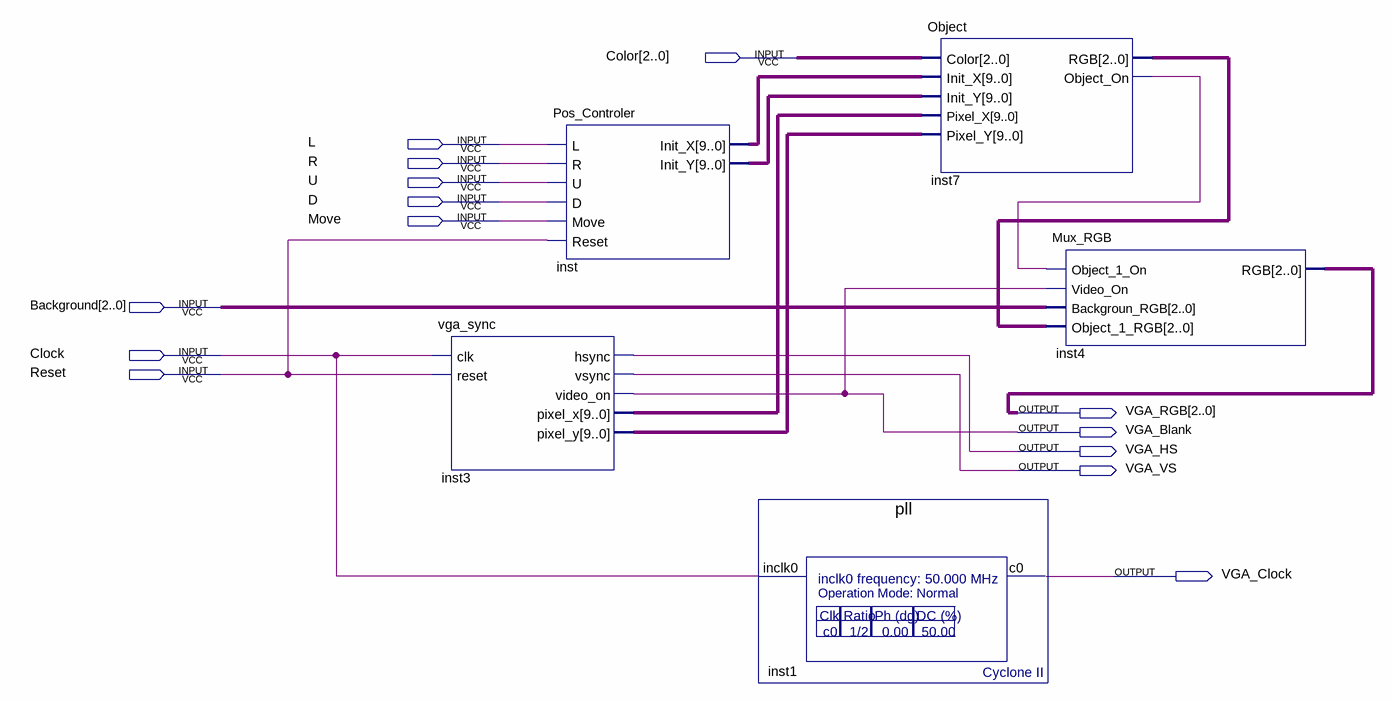
[diagram p0: schematic sheet]
// Quartus schematic vga.bdf as structural Verilog: 5 symbols, 14 pins
module vga (
  input  [2:0] Color,
  input  L,
  input  R,
  input  U,
  input  D,
  input  Move,
  input  [2:0] Background,
  input  Clock,
  input  Reset,
  output [2:0] VGA_RGB,
  output VGA_Blank,
  output VGA_HS,
  output VGA_VS,
  output VGA_Clock
);

  wire inst7_object_on;
  wire [2:0] inst7_rgb;
  wire [9:0] inst3_pixel_x, inst3_pixel_y, inst_init_x, inst_init_y;

  vga_sync inst3 (
    .clk(Clock), .reset(Reset), .hsync(VGA_HS), .vsync(VGA_VS), .video_on(VGA_Blank),
    .pixel_x(inst3_pixel_x), .pixel_y(inst3_pixel_y));
  Pos_Controler inst (
    .L(L), .R(R), .U(U), .D(D), .Move(Move), .Reset(Reset), .Init_X(inst_init_x), .Init_Y(inst_init_y));
  pll inst1 (.inclk0(Clock), .c0(VGA_Clock));
  Object inst7 (
    .Color(Color), .Init_X(inst_init_x), .Init_Y(inst_init_y), .Pixel_X(inst3_pixel_x),
    .Pixel_Y(inst3_pixel_y), .RGB(inst7_rgb), .Object_On(inst7_object_on));
  Mux_RGB inst4 (
    .Object_1_On(inst7_object_on), .Video_On(VGA_Blank), .Backgroun_RGB(Background),
    .Object_1_RGB(inst7_rgb), .RGB(VGA_RGB));
endmodule
